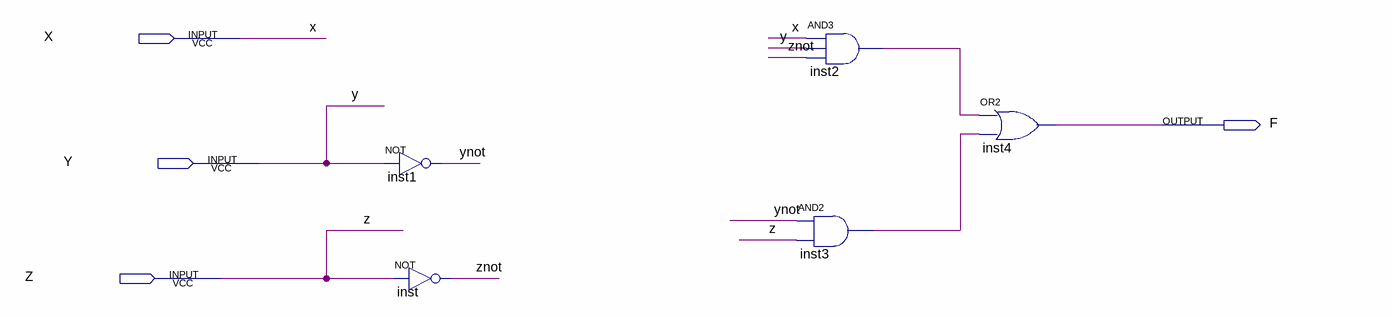
[diagram p0: schematic sheet]
// Quartus schematic Task2_Combination.bdf as structural Verilog: 5 symbols, 4 pins
module Task2_Combination (
  input  X,
  input  Y,
  input  Z,
  output F
);

  wire inst2_out, inst3_out, ynot, znot;

  not inst1 (ynot, Y);
  not inst (znot, Z);
  and inst2 (inst2_out, X, Y, znot);
  and inst3 (inst3_out, ynot, Z);
  or inst4 (F, inst2_out, inst3_out);
endmodule
